# EAGLE design MCB-EMW3166-v2.0.1 (EAGLE 7.7.0)

## Sheet 1 of 2
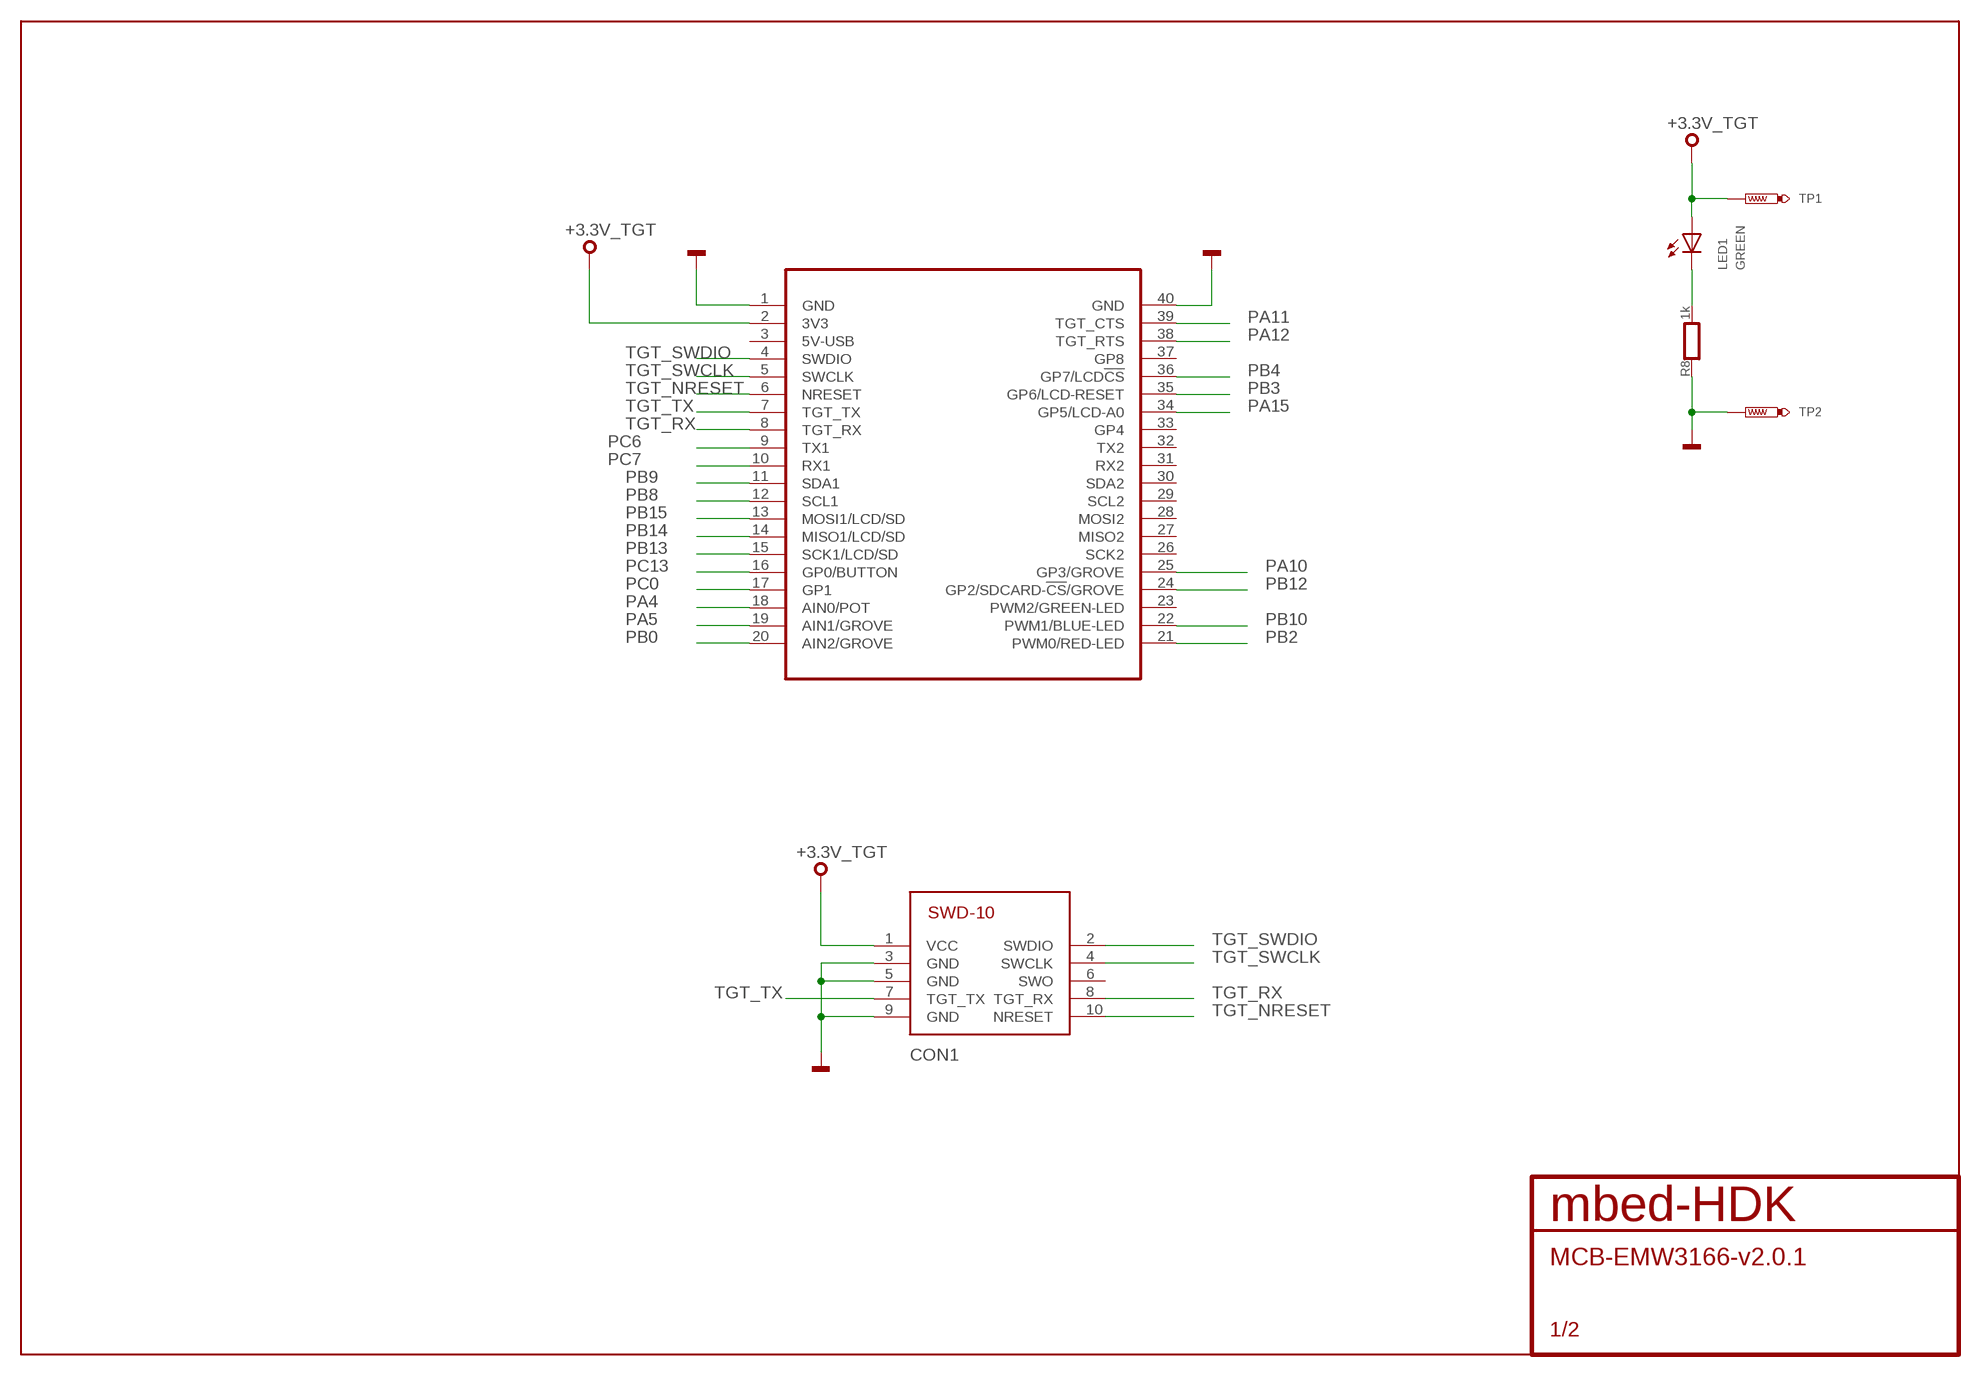
[diagram p0: schematic, sheet 1]

### Parts
CON1  SWD-10/TC2050_SMD  [FTSH-105-02]
LED1  GREEN  SMD_LED0603  [CHIPLED_0603]
MOD2  MODULE_DAUGHTER  [MODULE_DAUGHTER]
R8  1k  R0603  [0603]
TP1  TEST_POINT-50R-PTH  [TP50-PTH]
TP2  TEST_POINT-50R-PTH  [TP50-PTH]

### Nets
+3.3V_TGT: CON1.1(VCC) LED1.A MOD2.2(3V3) TP1.TP ; also sheet 2
GND: CON1.3(GND) CON1.5(GND) CON1.9(GND) MOD2.1(GND) MOD2.40(GND) R8.1 TP2.TP ; also sheet 2
PA4: MOD2.18(AIN0/POT) ; also sheet 2
PA5: MOD2.19(AIN1/GROVE) ; also sheet 2
PA10: MOD2.25(GP3/GROVE) ; also sheet 2
PA11: MOD2.39(TGT_CTS) ; also sheet 2
PA12: MOD2.38(TGT_RTS) ; also sheet 2
PA15: MOD2.34(GP5/LCD-A0) ; also sheet 2
PA_1: LED1.C R8.2
PB0: MOD2.20(AIN2/GROVE) ; also sheet 2
PB2: MOD2.21(PWM0/RED-LED) ; also sheet 2
PB3: MOD2.35(GP6/LCD-RESET) ; also sheet 2
PB4: MOD2.36(GP7/LCD!CS) ; also sheet 2
PB8: MOD2.12(SCL1) ; also sheet 2
PB9: MOD2.11(SDA1) ; also sheet 2
PB10: MOD2.22(PWM1/BLUE-LED) ; also sheet 2
PB12: MOD2.24(GP2/SDCARD-!CS!/GROVE) ; also sheet 2
PB13: MOD2.15(SCK1/LCD/SD) ; also sheet 2
PB14: MOD2.14(MISO1/LCD/SD) ; also sheet 2
PB15: MOD2.13(MOSI1/LCD/SD) ; also sheet 2
PC0: MOD2.17(GP1) ; also sheet 2
PC6: MOD2.9(TX1) ; also sheet 2
PC7: MOD2.10(RX1) ; also sheet 2
PC13: MOD2.16(GP0/BUTTON) ; also sheet 2
TGT_NRESET: CON1.10(NRESET) MOD2.6(NRESET) ; also sheet 2
TGT_RX: CON1.8(TGT_RX) MOD2.8(TGT_RX) ; also sheet 2
TGT_SWCLK: CON1.4(SWCLK) MOD2.5(SWCLK) ; also sheet 2
TGT_SWDIO: CON1.2(SWDIO) MOD2.4(SWDIO) ; also sheet 2
TGT_TX: CON1.7(TGT_TX) MOD2.7(TGT_TX) ; also sheet 2
Unconnected: CON1.6(SWO) MOD2.3(5V-USB) MOD2.23(PWM2/GREEN-LED) MOD2.26(SCK2) MOD2.27(MISO2) MOD2.28(MOSI2) MOD2.29(SCL2) MOD2.30(SDA2) MOD2.31(RX2) MOD2.32(TX2) MOD2.33(GP4) MOD2.37(GP8)

## Sheet 2 of 2
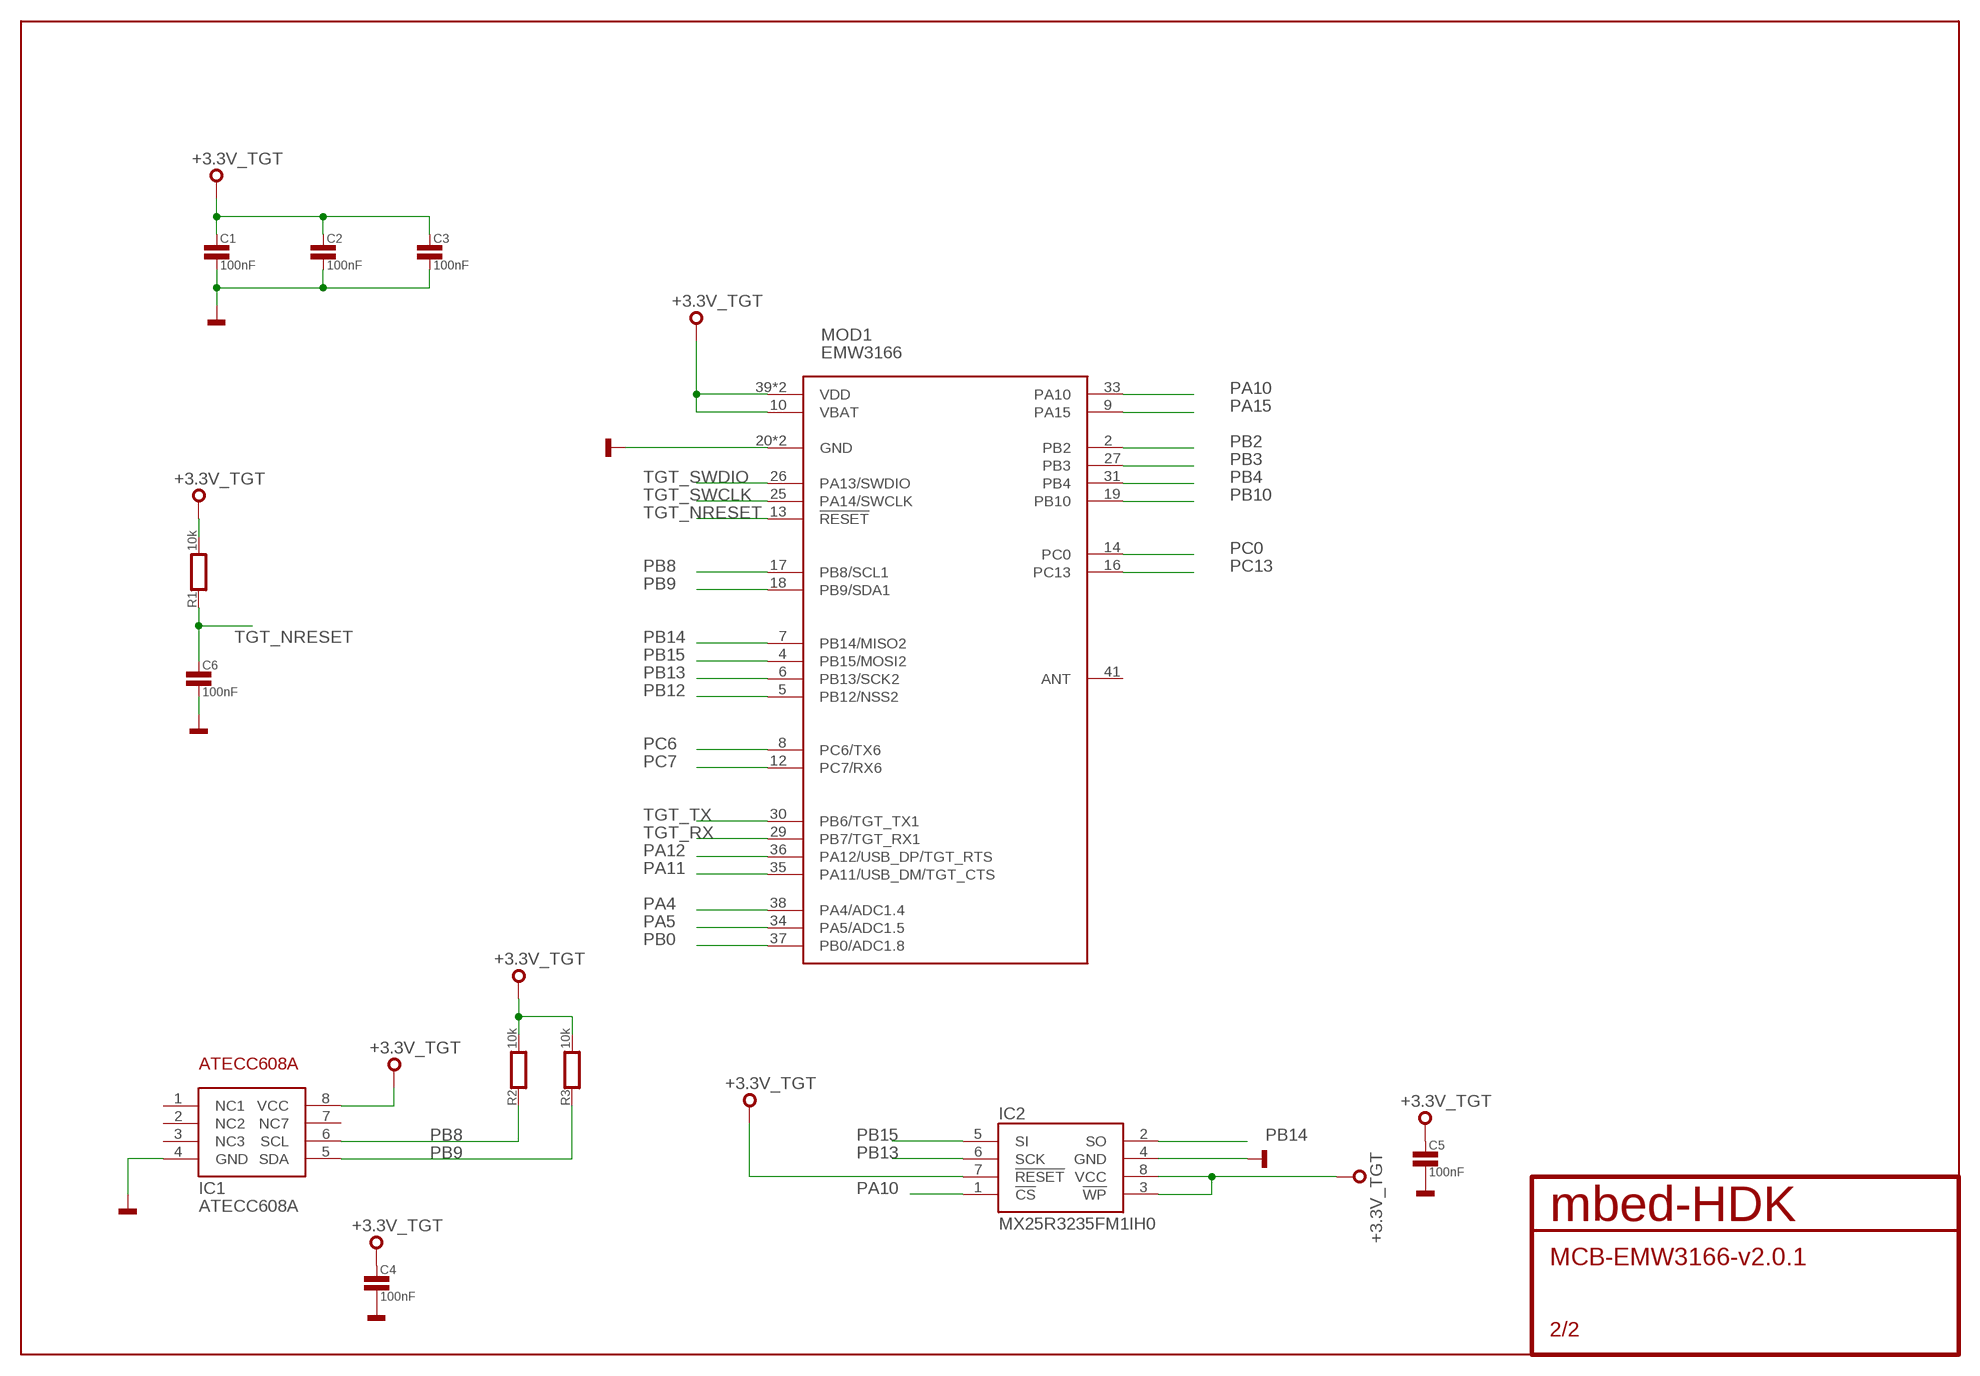
[diagram p1: schematic, sheet 2]

### Parts
C1  100nF  C0603  [0603]
C2  100nF  C0603  [0603]
C3  100nF  C0603  [0603]
C4  100nF  C0603  [0603]
C5  100nF  C0603  [0603]
C6  100nF  C0603  [0603]
IC1  ATECC608A  [SO8]
IC2  MX25R3235FM1IH0  [SO8]
MOD1  EMW3166  [EMW3166]
R1  10k  R0603  [0603]
R2  10k  R0603  [0603]
R3  10k  R0603  [0603]

### Nets
+3.3V_TGT: C1.1 C2.1 C3.1 C4.1 C5.1 IC1.8(VCC) IC2.3(!WP) IC2.7(!RESET) IC2.8(VCC) MOD1.10(VBAT) MOD1.39(VDD) MOD1.40(VDD) R1.2 R2.2 R3.2 ; also sheet 1
GND: C1.2 C2.2 C3.2 C4.2 C5.2 C6.2 IC1.4(GND) IC2.4(GND) MOD1.20(GND) MOD1.21(GND) ; also sheet 1
PA4: MOD1.38(PA4/ADC1.4) ; also sheet 1
PA5: MOD1.34(PA5/ADC1.5) ; also sheet 1
PA10: IC2.1(!CS) MOD1.33(PA10) ; also sheet 1
PA11: MOD1.35(PA11/USB_DM/TGT_CTS) ; also sheet 1
PA12: MOD1.36(PA12/USB_DP/TGT_RTS) ; also sheet 1
PA15: MOD1.9(PA15) ; also sheet 1
PB0: MOD1.37(PB0/ADC1.8) ; also sheet 1
PB2: MOD1.2(PB2) ; also sheet 1
PB3: MOD1.27(PB3) ; also sheet 1
PB4: MOD1.31(PB4) ; also sheet 1
PB8: IC1.6(SCL) MOD1.17(PB8/SCL1) R2.1 ; also sheet 1
PB9: IC1.5(SDA) MOD1.18(PB9/SDA1) R3.1 ; also sheet 1
PB10: MOD1.19(PB10) ; also sheet 1
PB12: MOD1.5(PB12/NSS2) ; also sheet 1
PB13: IC2.6(SCK) MOD1.6(PB13/SCK2) ; also sheet 1
PB14: IC2.2(SO) MOD1.7(PB14/MISO2) ; also sheet 1
PB15: IC2.5(SI) MOD1.4(PB15/MOSI2) ; also sheet 1
PC0: MOD1.14(PC0) ; also sheet 1
PC6: MOD1.8(PC6/TX6) ; also sheet 1
PC7: MOD1.12(PC7/RX6) ; also sheet 1
PC13: MOD1.16(PC13) ; also sheet 1
TGT_NRESET: C6.1 MOD1.13(!RESET) R1.1 ; also sheet 1
TGT_RX: MOD1.29(PB7/TGT_RX1) ; also sheet 1
TGT_SWCLK: MOD1.25(PA14/SWCLK) ; also sheet 1
TGT_SWDIO: MOD1.26(PA13/SWDIO) ; also sheet 1
TGT_TX: MOD1.30(PB6/TGT_TX1) ; also sheet 1
Unconnected: IC1.1(NC1) IC1.2(NC2) IC1.3(NC3) IC1.7(NC7) MOD1.41(ANT)

## Library data of the parts
C1-C6 = mbed-HDK-RLC:C: Capacitor
CON1 = mbed-HDK-Connector:SWD-10/TC2050: 1mm pitch 10-Pin Cortex Programming Header with optional TC2050 footprint solderless interchangeable
IC1 = mbed-HDK-MF-ATMEL:ATECC608A: I2C Secure element and crytpo accelerator; MF: Atmel; MFN: ATECC608A; OC-DIGIKEY: ATECC608A-SSHDA-TCT-ND; OC-MOUSER: 556-ATECC608ASSHDAB
IC2 = mbed-HDK-IC:MX25R3235FM1IH0: Serial Flash 32 Mb 80 Mhz; MF: Macronix; MFN: MX25R3235FM1IH0; OC-DIGIKEY: 1092-1175-ND
LED1 = mbed-HDK-Optical:SMD_LED: LED SMD, Colour Red; MF: Wurth Electronics Inc; MFN: 150060RS75000; OC-DIGIKEY: 732-4978-1-ND; OC-MOUSER: 710-150060RS75000; OC-NEWARK: 2322071
MOD1 = mbed-HDK-Modules:EMW3166
MOD2 = mbed-HDK-misc-Board:MODULE_DAUGHTER
R1-R3 R8 = mbed-HDK-RLC:R: Resistor
TP1 TP2 = mbed-HDK-Connector:TEST_POINT

## Board
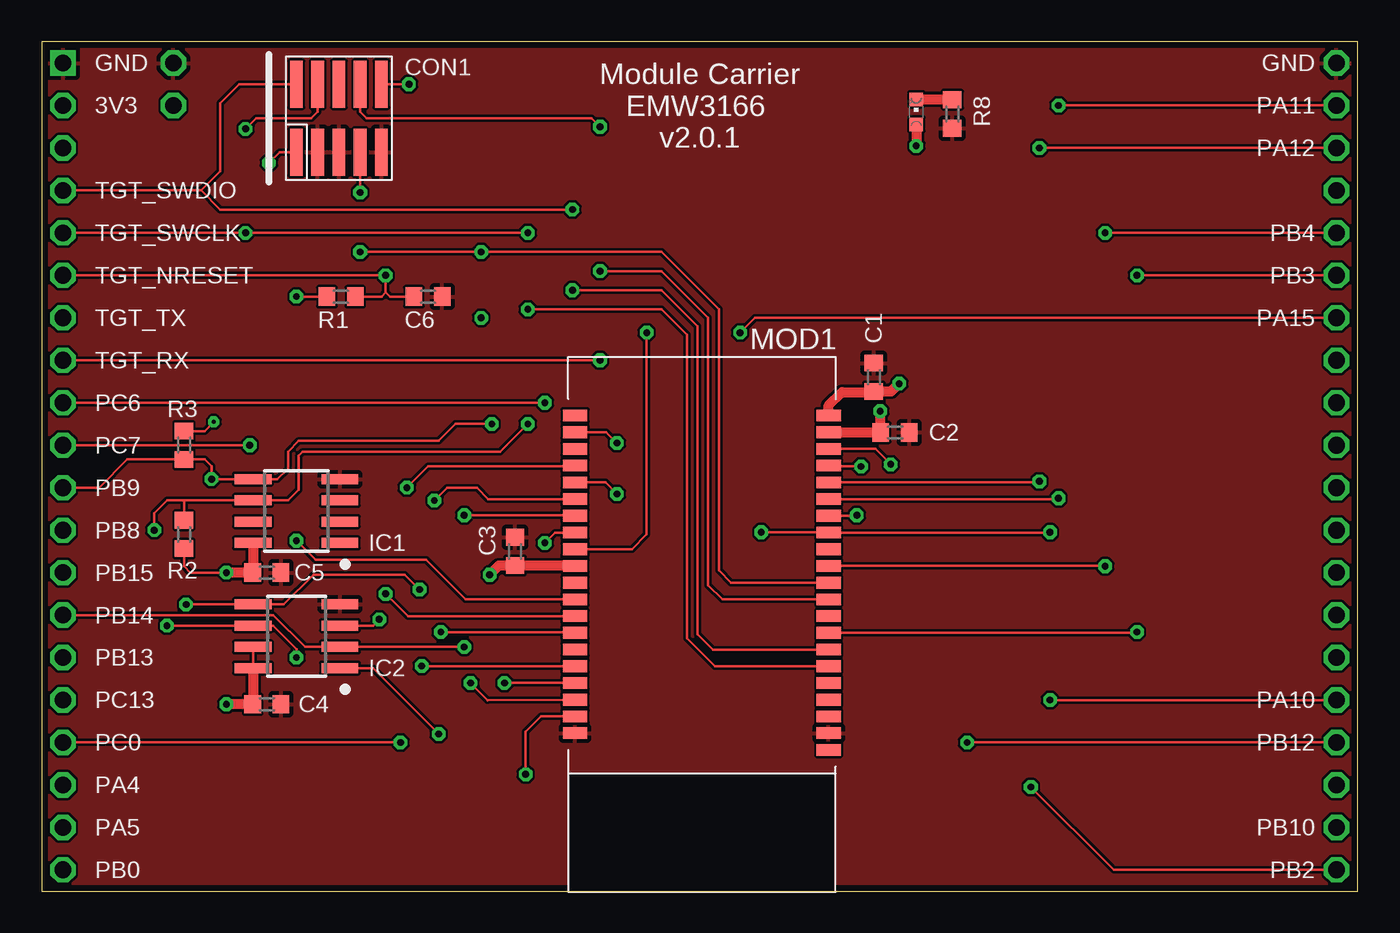
[diagram p2: board, top side]
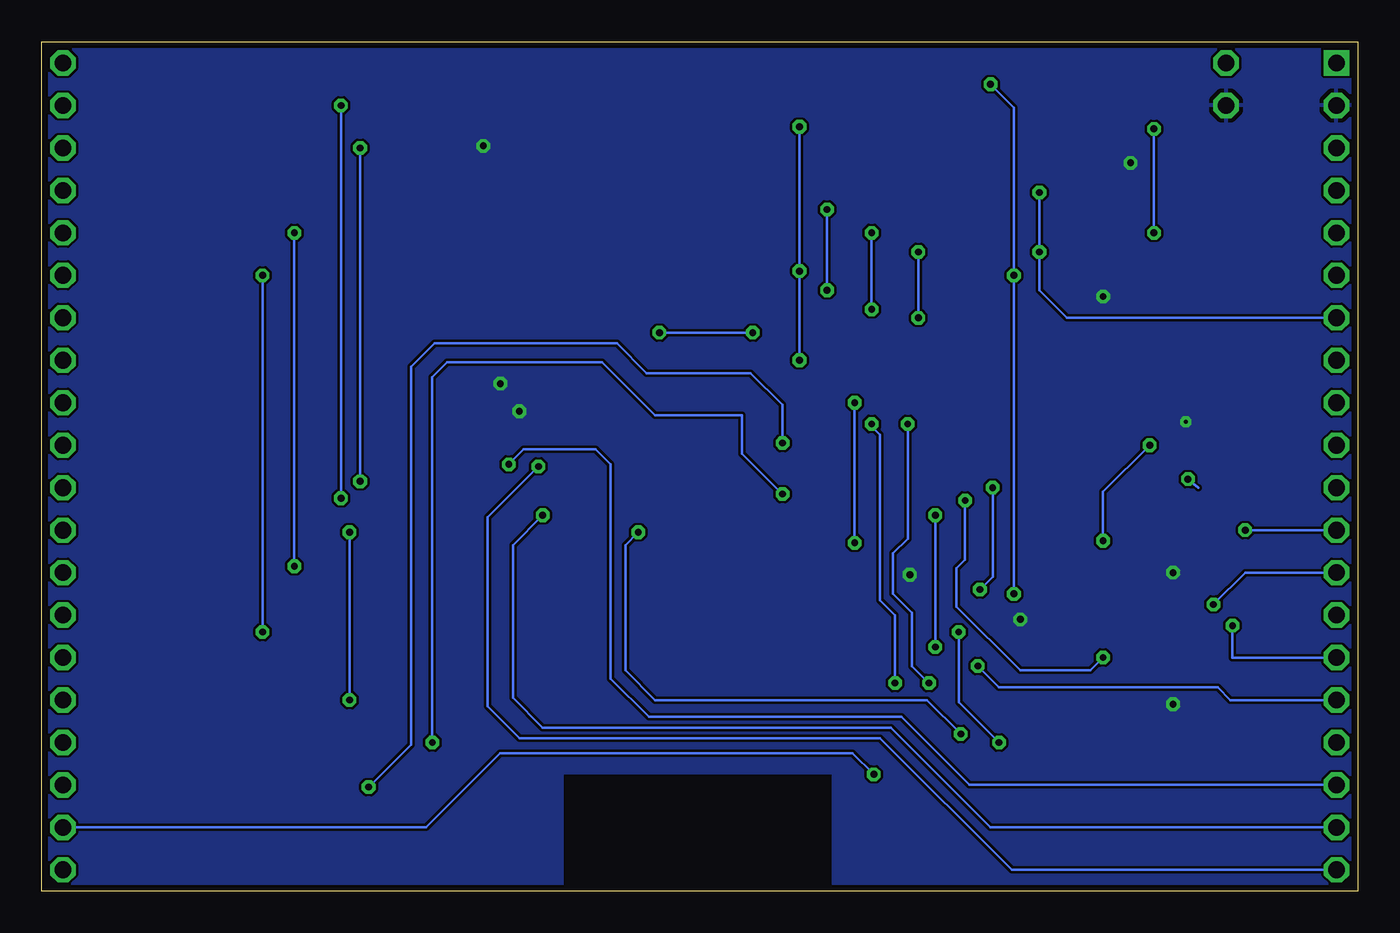
[diagram p3: board, bottom side, seen from below]

Size 78.74 x 50.8 mm. Coordinates in mm from the lower left corner, seen from the top.
Copper layers ((1*16)): Top 0.035mm / dielectric 0.8mm / Bottom 0.035mm
Design rules "mbed-HDK-6-6-2-layer": minimum track width 6mil, minimum drill 9mil, track to track 6mil, track to pad 6mil, pad to pad 6mil, via to via 6mil, smd to smd 6mil, copper to edge 15mil, drill to drill 8mil, minimum pad ring 10mil, minimum via ring 8mil, stop-mask expansion 4mil, vias tented up to drill 0mil, thermal gap 10mil

### Footprints (pad centres in the part's own frame; a part is rotated, then mirrored left to right if it is on the bottom)
0603 = smd 1 x 1.1: 1 -0.85,0; 2 0.85,0
FTSH-105-02 = smd 0.762 x 2.794: 1 0.381,-2.032; 2 0.381,2.032; 3 1.651,-2.032; 4 1.651,2.032; 5 2.921,-2.032; 6 2.921,2.032; 7 4.191,-2.032; 8 4.191,2.032; 9 5.461,-2.032; 10 5.461,2.032
SO8 = smd 0.6 x 2.2: 1 -1.905,-2.6; 2 -0.635,-2.6; 3 0.635,-2.6; 4 1.905,-2.6; 5 1.905,2.6; 6 0.635,2.6; 7 -0.635,2.6; 8 -1.905,2.6
CHIPLED_0603 = smd 0.8 x 0.8: A 0,-0.75; C 0,0.75
EMW3166 = smd 0.7 x 1.45: 1 0,7.585; 2 -1,7.585; 3 -2,7.585; 4 -3,7.585; 5 -4,7.585; 6 -5,7.585; 7 -6,7.585; 8 -7,7.585; 9 -8,7.585; 10 -9,7.585; 11 -10,7.585; 12 -11,7.585; 13 -12,7.585; 14 -13,7.585; 15 -14,7.585; 16 -15,7.585; 17 -16,7.585; 18 -17,7.585; 19 -18,7.585; 20 -19,7.585; 21 -19,-7.585; 22 -18,-7.585; 23 -17,-7.585; 24 -16,-7.585; 25 -15,-7.585; 26 -14,-7.585; 27 -13,-7.585; 28 -12,-7.585; 29 -11,-7.585; 30 -10,-7.585; 31 -9,-7.585; 32 -8,-7.585; 33 -7,-7.585; 34 -6,-7.585; 35 -5,-7.585; 36 -4,-7.585; 37 -3,-7.585; 38 -2,-7.585; 39 -1,-7.585; 40 0,-7.585; 41 -20,-7.585
MODULE_DAUGHTER = drill 1 square: 1 0,0 | drill 1 octagon: 2 0,-2.54; 3 0,-5.08; 4 0,-7.62; 5 0,-10.16; 6 0,-12.7; 7 0,-15.24; 8 0,-17.78; 9 0,-20.32; 10 0,-22.86; 11 0,-25.4; 12 0,-27.94; 13 0,-30.48; 14 0,-33.02; 15 0,-35.56; 16 0,-38.1; 17 0,-40.64; 18 0,-43.18; 19 0,-45.72; 20 0,-48.26; 21 76.2,-48.26; 22 76.2,-45.72; 23 76.2,-43.18; 24 76.2,-40.64; 25 76.2,-38.1; 26 76.2,-35.56; 27 76.2,-33.02; 28 76.2,-30.48; 29 76.2,-27.94; 30 76.2,-25.4; 31 76.2,-22.86; 32 76.2,-20.32; 33 76.2,-17.78; 34 76.2,-15.24; 35 76.2,-12.7; 36 76.2,-10.16; 37 76.2,-7.62; 38 76.2,-5.08; 39 76.2,-2.54; 40 76.2,0
TP50-PTH = drill 1 octagon: TP 0,0

### Placement (x,y rotation side)
C1  49.78,30.73 90 top
C2  51.05,27.43 0 top
C3  28.32,20.32 90 top
C4  13.46,11.18 0 top
C5  13.46,19.05 0 top
C6  23.11,35.56 0 top
CON1  14.86,46.23 0 top
IC1  15.24,22.73 90 top
IC2  15.24,15.24 90 top
LED1  52.32,46.61 0 top
MOD1  39.5,28.45 90 top
MOD2  1.27,49.53 0 top
R1  17.91,35.56 180 top
R2  8.51,21.34 270 top
R3  8.51,26.67 90 top
R8  54.48,46.48 90 top
TP1  7.87,46.99 0 top
TP2  7.87,49.53 0 top

### Tracks (layer width: path | path; a pad name or v marks a point on that pad's centre or on a via)
+3.3V_TGT  (via drill 0.25, 0.41)
  Top 0.152: IC2.7 IC2.8 | IC2.3 19.81,15.88 v20.19,16.26 | CON1.1 14.22,44.2 v13.59,43.56 | R1.2 v15.24,35.56 | R2.2 8.51,19.43 8.89,19.05 v11.05,19.05 | R3.2 9.74,27.52 v10.29,28.07
  Top 0.61: MOD1.40 47.08,29.05 47.88,29.84 49.74,29.84 C1.1 50.84,29.88 v51.31,30.35 | v50.16,28.7 50.16,27.47 C2.1 50.19,27.45 MOD1.39 | MOD1.10 28.34,19.45 C3.1 27.34,19.47 v26.8,18.92 | LED1.A v52.32,44.58 | IC1.8 12.64,19.08 C5.1 v11.05,19.05 | v11.05,11.18 C4.1 12.64,11.2 IC2.8
  pour Bottom: 0,0 78.74,0 78.74,50.8 0,50.8
GND
  pour Top: 0,0 78.74,0 78.74,50.8 0,50.8
PA4  (via drill 0.41)
  Top 0.152: v50.8,25.53 49.88,26.45 MOD1.38
  Bottom 0.152: v50.8,25.53 49.91,26.42 45.59,26.42 44.7,25.53 44.7,12.7 42.42,10.41 27.3,10.41 23.24,6.35 MOD2.18
PA5  (via drill 0.41)
  Top 0.152: MOD1.34 48.74,22.45 v48.77,22.48
  Bottom 0.152: v48.77,22.48 50.55,20.7 50.55,11.56 48.77,9.78 27.94,9.78 21.97,3.81 MOD2.19
PA10  (via drill 0.41)
  Top 0.152: v60.33,21.46 60.31,21.45 MOD1.33 47.07,21.46 v43.05,21.46 | IC2.1 19.81,13.34 v23.75,9.4 | v60.33,11.43 MOD2.25
  Bottom 0.152: v60.33,21.46 v60.33,11.43 | v23.75,9.4 25.78,11.43 42.04,11.43 43.81,13.21 43.81,20.7 v43.05,21.46
PA11  (via drill 0.41)
  Top 0.152: MOD1.35 60.79,23.45 v60.83,23.5 | v60.83,46.99 MOD2.39
  Bottom 0.152: v60.83,23.5 v60.83,46.99
PA12  (via drill 0.41)
  Top 0.152: MOD1.36 59.63,24.45 v59.69,24.51 | v59.69,44.45 MOD2.38
  Bottom 0.152: v59.69,24.51 v59.69,44.45
PA15  (via drill 0.41)
  Top 0.152: v41.78,33.4 42.67,34.29 MOD2.34 | v36.2,33.4 36.2,21.34 35.31,20.45 MOD1.9
  Bottom 0.152: v41.78,33.4 v36.2,33.4
PA_1
  Top 0.61: LED1.C 54.46,47.36 R8.2
PB0  (via drill 0.41)
  Top 0.152: MOD1.37 47.13,25.4 v49.02,25.4
  Bottom 0.152: v49.02,25.4 52.07,22.35 52.07,11.05 50.16,9.14 28.57,9.14 20.7,1.27 MOD2.20
PB2  (via drill 0.41)
  Top 0.152: MOD1.2 33.77,27.45 v34.42,26.8 | v59.18,6.22 64.14,1.27 MOD2.21
  Bottom 0.152: v34.42,26.8 34.42,29.08 36.32,30.99 42.55,30.99 44.32,32.77 55.24,32.77 56.64,31.37 56.64,8.76 v59.18,6.22
PB3  (via drill 0.41)
  Top 0.152: MOD1.27 65.49,15.45 v65.53,15.49 | v65.53,36.83 MOD2.35
  Bottom 0.152: v65.53,15.49 v65.53,36.83
PB4  (via drill 0.41)
  Top 0.152: MOD1.31 63.61,19.45 v63.63,19.43 | v63.63,39.37 MOD2.36
  Bottom 0.152: v63.63,19.43 v63.63,39.37
PB8  (via drill 0.41)
  Top 0.152: v6.73,21.59 6.73,22.61 7.49,23.37 8.51,23.37 | 8.51,23.37 IC1.6 14.73,23.37 15.37,24 15.37,26.04 15.62,26.29 27.43,26.29 v29.08,27.94 | MOD1.17 v27.69,12.45 | R2.1 8.51,23.37
  Bottom 0.152: v27.69,12.45 27.69,16.51 28.57,17.4 28.57,27.3 29.08,27.81 v29.08,27.94 | v6.73,21.59 MOD2.12
PB9  (via drill 0.41)
  Top 0.152: MOD1.18 26.67,11.43 25.67,12.43 25.67,12.46 v25.65,12.45 | v26.92,27.94 24.77,27.94 23.75,26.92 18.67,26.92 15.37,26.92 14.73,26.29 14.73,25.27 14.1,24.64 IC1.5 v10.16,24.64 10.16,25.4 9.74,25.82 R3.1 5.12,25.82 3.43,24.13 MOD2.11
  Bottom 0.152: 9.53,24.13 v10.16,24.64 | v25.65,12.45 26.67,13.46 26.67,16.64 27.81,17.78 27.81,20.19 26.92,21.08 v26.92,27.94
PB10  (via drill 0.41)
  Top 0.152: MOD1.19 29.88,10.45 28.96,9.53 v28.96,6.99
  Bottom 0.152: v28.96,6.99 30.23,8.26 51.31,8.26 55.75,3.81 MOD2.22
PB12  (via drill 0.41)
  Top 0.152: MOD1.5 33.72,24.45 v34.42,23.75 | v55.37,8.89 MOD2.24
  Bottom 0.152: v34.42,23.75 36.83,26.16 36.83,28.45 42.04,28.45 45.21,31.62 54.48,31.62 55.37,30.73 v55.37,8.89
PB13  (via drill 0.41)
  Top 0.152: v7.49,15.88 IC2.6 13.84,15.88 15.24,14.48 v15.24,13.97 | MOD1.6 26.72,23.45 26.04,24.13 24.26,24.13 v23.5,23.37
  Bottom 0.152: v7.49,15.88 7.49,13.97 MOD2.15 | v23.5,23.37 23.5,19.81 24,19.3 24,17.02 20.19,13.21 16,13.21 v15.24,13.97
PB14  (via drill 0.41)
  Top 0.152: v25.27,14.61 IC2.2 15.75,14.61 13.84,16.51 MOD2.14 | v25.27,22.48 31.88,22.48 MOD1.7
  Bottom 0.152: v25.27,14.61 v25.27,22.48
PB15  (via drill 0.41)
  Top 0.152: v8.64,17.14 IC2.5 14.48,17.14 16.26,18.92 21.72,18.92 v22.61,18.03 | v21.84,24.13 23.11,25.4 31.86,25.4 MOD1.4
  Bottom 0.152: v8.64,17.14 6.73,19.05 MOD2.13 | v22.61,18.03 21.84,18.8 v21.84,24.13
PC0  (via drill 0.41)
  Top 0.152: v23.88,15.49 31.87,15.49 MOD1.14 | v21.46,8.89 MOD2.17
  Bottom 0.152: v21.46,8.89 23.88,11.3 v23.88,15.49
PC6  (via drill 0.41)
  Top 0.152: MOD1.8 30.72,21.45 v30.1,20.83 | v30.1,29.21 MOD2.9
  Bottom 0.152: v30.1,20.83 v30.1,29.21
PC7  (via drill 0.41)
  Top 0.152: MOD1.12 25.35,17.45 22.99,19.81 16.38,19.81 v15.24,20.95 | v12.45,26.67 MOD2.10
  Bottom 0.152: v15.24,20.95 15.24,23.88 v12.45,26.67
PC13  (via drill 0.41)
  Top 0.152: MOD1.16 22.75,13.45 v22.73,13.46
  Bottom 0.152: v22.73,13.46 21.46,12.19 8.38,12.19 7.62,11.43 MOD2.16
TGT_NRESET  (via drill 0.41)
  Top 0.152: MOD1.13 21.91,16.45 v20.57,17.78 | v21.97,48.26 CON1.10 | 20.57,35.81 20.32,35.56 19.3,35.56 R1.1 | 20.57,35.81 v20.57,36.83 MOD2.6 | C6.1 20.83,35.56 20.57,35.81
  Bottom 0.152: v20.57,17.78 v20.57,36.83 20.57,46.86 v21.97,48.26
TGT_RX  (via drill 0.41)
  Top 0.152: MOD1.29 40.72,17.45 39.88,18.29 39.88,34.29 37.08,37.08 v33.4,37.08 | v33.4,31.75 30.48,31.75 29.72,31.75 MOD2.8 | CON1.8 19.05,46.61 19.43,46.23 32.89,46.23 v33.4,45.72
  Bottom 0.152: v33.4,31.75 v33.4,37.08 v33.4,45.72
TGT_SWCLK  (via drill 0.41)
  Top 0.152: MOD1.25 40.27,13.45 38.61,15.11 38.61,33.27 37.08,34.8 v29.08,34.8 | CON1.4 16.51,46.61 16.13,46.23 12.83,46.23 v12.19,45.59 | v29.08,39.37 v12.19,39.37 MOD2.5
  Bottom 0.152: v12.19,45.59 v12.19,39.37 | v29.08,34.8 v29.08,39.37
TGT_SWDIO  (via drill 0.41)
  Top 0.152: MOD1.26 40.16,14.45 39.24,15.37 39.24,33.78 37.08,35.94 v31.75,35.94 | v31.75,40.77 10.67,40.77 9.53,41.91 | CON1.2 11.81,48.26 10.67,47.12 10.67,43.05 9.53,41.91 | MOD2.4 9.53,41.91
  Bottom 0.152: v31.75,40.77 v31.75,35.94
TGT_TX  (via drill 0.41)
  Top 0.152: MOD1.30 41.24,18.45 40.51,19.18 40.51,34.8 37.08,38.23 v26.29,38.23 v19.05,38.23 | CON1.7 v19.05,41.78
  Bottom 0.152: v26.29,38.23 v26.29,34.29 | v19.05,41.78 v19.05,38.23 19.05,35.94 17.4,34.29 MOD2.7

### Text on the board
tPlace: GND / 3V3 / / TGT_SWDIO / TGT_SWCLK / TGT_NRESET / TGT_TX / TGT_RX / PC6 / PC7 / PB9 / PB8 / PB15 / PB14 / PB13 / PC13 / PC0 / PA4 / PA5 / PB0 | GND / PA11 / PA12 / / PB4 / PB3 / PA15 / / / / / / / / / PA10 / PB12 / / PB10 / PB2 | Module Carrier / EMW3166 / v2.0.1